# EAGLE schematic BluetoothMainBoard (EAGLE 7.6.0)
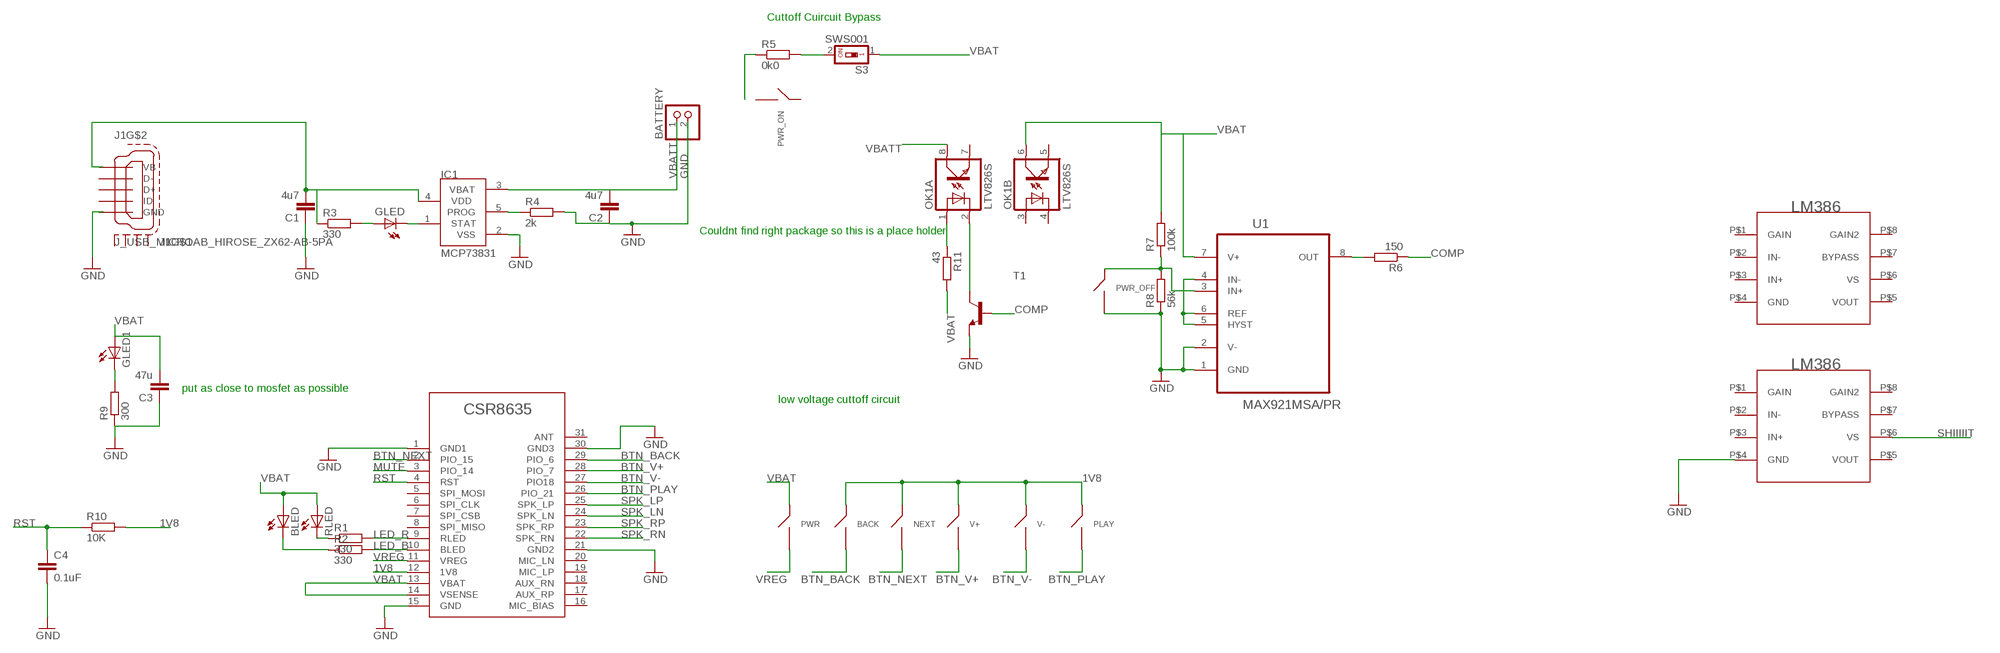
[diagram p0: schematic, sheet 1]

## Parts
BACK  TACTILE  [DTSM31N]
BATTERY  PINHD-1X2  [1X02]
BLED  LEDCHIPLED_1206  [CHIPLED_1206]
C1  4u7  C-EUC0805  [C0805]
C2  4u7  C-EUC0805  [C0805]
C3  47u  C-EUC0805  [C0805]
C4  0.1uF  C-EUC0805  [C0805]
GLED  LEDCHIP-LED0805  [CHIP-LED0805]
GLED1  LEDCHIP-LED0805  [CHIP-LED0805]
IC1  MCP73831  [SOT23-5L]
J1  J_USB_MICROAB_HIROSE_ZX62-AB-5PA  [J_USB_MICROAB_HIROSE_ZX62-AB-5PA]
NEXT  TACTILE  [DTSM31N]
OK1  LTV826S  [DIL8-SMD]
PLAY  TACTILE  [DTSM31N]
PWR  TACTILE  [DTSM31N]
PWR_OFF  TACTILE  [DTSM31N]
PWR_ON  TACTILE  [DTSM31N]
R1  330  R-EU_R0805W  [R0805W]
R2  330  R-EU_R0805W  [R0805W]
R3  330  R-EU_R0805W  [R0805W]
R4  2k  R-EU_R0805W  [R0805W]
R5  0k0  R-EU_R0805W  [R0805W]
R6  150  R-EU_R0805W  [R0805W]
R7  100k  R-EU_R0805W  [R0805W]
R8  56k  R-EU_R0805W  [R0805W]
R9  300  R-EU_R0805W  [R0805W]
R10  10K  R-EU_R0805W  [R0805W]
R11  43  R-EU_R0805W  [R0805W]
RLED  LEDCHIPLED_1206  [CHIPLED_1206]
S3  SWS001  [SMS-001]
T1  BC817-16-NPN-SOT23-BEC  [SOT23-BEC]
U1  MAX921MSA/PR  [SOIC127P600X175-8N]
U$1  CSR8635BRANDON_PINER  [CSR8635PACKAGE]
U$2  LM386  [LM386]
U$3  LM386  [LM386]
V+  TACTILE  [DTSM31N]
V-  TACTILE  [DTSM31N]

## Nets
1V8: BACK.P$1 NEXT.P$1 PLAY.P$1 R10.2 U$1.12(1V8) V+.P$1 V-.P$1
BTN_BACK: BACK.P$2 U$1.29(PIO_6)
BTN_NEXT: NEXT.P$2 U$1.2(PIO_15)
BTN_PLAY: PLAY.P$2 U$1.26(PIO_21)
BTN_V+: U$1.28(PIO_7) V+.P$2
BTN_V-: U$1.27(PIO18) V-.P$2
COMP: R6.1 T1.B
GND: BATTERY.2 C1.1 C2.1 C3.1 C4.2 IC1.2(VSS) PWR_OFF.P$2 R4.2 R8.1 R9.1 T1.E U1.1(GND) U1.2(V-) U$1.1(GND1) U$1.15(GND) U$1.21(GND2) U$1.30(GND3) U$2.P$4(GND)
LED_B: R2.2 U$1.10(BLED)
LED_R: R1.2 U$1.9(RLED)
MUTE: U$1.3(PIO_14)
N$1: R1.1 RLED.C
N$2: OK1.1(A:A) R11.1
N$3: IC1.5(PROG) R4.1
N$4: R5.1
N$5: U1.4(IN-) U1.5(HYST) U1.6(REF)
N$6: BLED.C R2.1
N$7: OK1.2(A:C) T1.C
N$11: R6.2 U1.8(OUT)
N$12: GLED.C IC1.1(STAT)
N$13: GLED.A R3.2
N$15: C1.2 IC1.4(VDD) R3.1
N$18: PWR_OFF.P$1 R7.1 R8.2 U1.3(IN+)
N$19: R5.2 S3.2
N$20: GLED1.C R9.2
RST: C4.1 R10.1 U$1.4(RST)
SHIIIIIT: U$2.P$6(VS)
SPK_LN: U$1.24(SPK_LN)
SPK_LP: U$1.25(SPK_LP)
SPK_RN: U$1.22(SPK_RN)
SPK_RP: U$1.23(SPK_RP)
VBAT: BLED.A C3.2 GLED1.A OK1.6(B:COL) PWR.P$1 R7.2 R11.2 RLED.A S3.1 U1.7(V+) U$1.13(VBAT) U$1.14(VSENSE)
VBATT: BATTERY.1 C2.2 IC1.3(VBAT) OK1.8(A:COL)
VREG: PWR.P$2 U$1.11(VREG)
Unconnected: J1.P$1(VB) J1.P$2(D-) J1.P$3(D+) J1.P$4(ID) J1.P$5(GND) J1.SHIELD1(S1) J1.SHIELD2(S2) J1.SHIELD3(S3) J1.SHIELD4(S4) OK1.3(B:A) OK1.4(B:C) OK1.5(B:EMIT) OK1.7(A:EMIT) PWR_ON.P$1 PWR_ON.P$2 U$1.5(SPI_MOSI) U$1.6(SPI_CLK) U$1.7(SPI_CSB) U$1.8(SPI_MISO) U$1.16(MIC_BIAS) U$1.17(AUX_RP) U$1.18(AUX_RN) U$1.19(MIC_LP) U$1.20(MIC_LN) U$1.31(ANT) U$2.P$1(GAIN) U$2.P$2(IN-) U$2.P$3(IN+) U$2.P$5(VOUT) U$2.P$7(BYPASS) U$2.P$8(GAIN2) U$3.P$1(GAIN) U$3.P$2(IN-) U$3.P$3(IN+) U$3.P$4(GND) U$3.P$5(VOUT) U$3.P$6(VS) U$3.P$7(BYPASS) U$3.P$8(GAIN2)

## Notes on the sheet
- Cuttoff Cuircuit Bypass
- Couldnt find right package so this is a place holder
- put as close to mosfet as possible
- low voltage cuttoff circuit

## Library data of the parts
BACK NEXT PLAY PWR PWR_OFF PWR_ON V+ V- = Communica:TACTILE
BATTERY = pinhead:PINHD-1X2: PIN HEADER
BLED RLED = adafruit:LED: LED
C1-C4 = rcl:C-EU: CAPACITOR, European symbol
GLED GLED1 = led:LED: LED
IC1 = microchip-update-2:MCP73831: Miniature Single-Cell, Fully Integrated Li-Ion, Li-Polymer Charge Management Controllers
J1 = j_usb_hirose_zx62-ab-5pa:J_USB_MICROAB_HIROSE_ZX62-AB-5PA: USB Micro-AB SMT connector Hirose Electric Co Ltd: ZX62-AB-5P
OK1 = optocoupler:LTV826: OPTO COUPLER Source: LITEON, LTV816.pdf; OC_FARNELL: unknown; OC_NEWARK: unknown
R1-R11 = rcl:R-EU_: RESISTOR, European symbol
S3 = smd-special:SWS001: SMD Dip Switch 1 pol.
T1 = transistor-neu-to92:*-NPN-: NPN Transistror
U1 = Maxim_By_element14_Batch_1:MAX921MSA/PR: Ultra-Low-Power Single/Dual Supply Comparator with 1% Precision Reference; MPN: MAX921MSA/PR; OC_FARNELL: -; OC_NEWARK: 05R7801; PACKAGE: SO-8; SUPPLIER: Maxim
U$1 = CSR8635:CSR8635
U$2 U$3 = Communica:LM386